# Altium schematic sheet Module - LCD.SchDoc
size A4; SheetNumber: 37; SheetTotal: 41
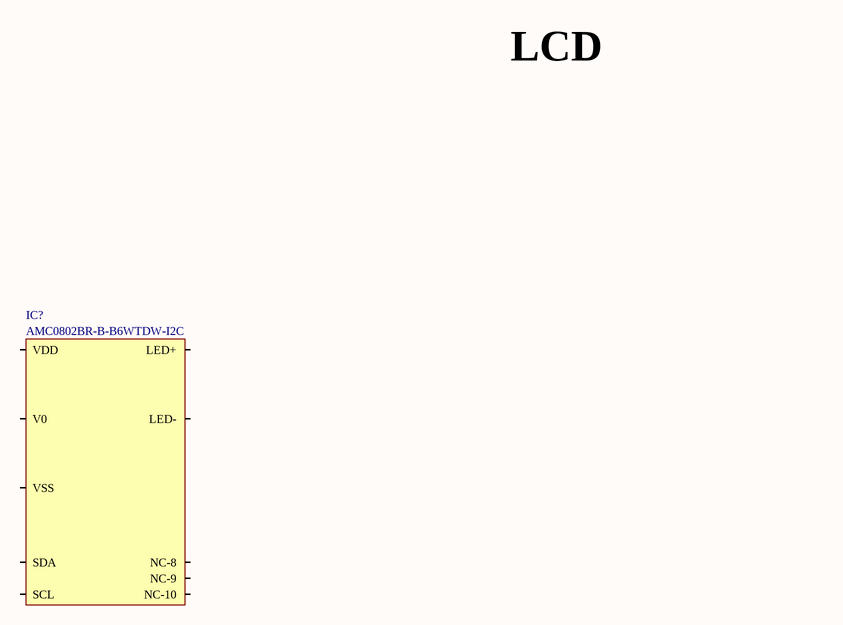
[diagram p0: Module - LCD.SchDoc]

## Parts
IC?  Manufacturer Part Number: AMC0802BR-B-B6WTDW-I2C  [Orient, AMC0802BR-B-B6WTDW-I2C]  (hidden comment: Orient, AMC0802BR-B-B6WTDW-I2C)

## Nets

Not connected (* = marked no-connect by the designer): IC? LED+ LED- NC-8 NC-9 NC-10 SCL SDA V0 VDD VSS

## Notes on the sheet
- LCD

## Library data of the parts
IC? = Orient, AMC0802BR-B-B6WTDW-I2C: Module, Display, Lcd, 2 Lines, I2C; Manufacturer: Orient Display; ComponentLink1Description: Datasheet; ComponentLink1URL: E:\Altium\Datasheets\Module - LCD\Orient, AMC0802BR-B-B6WTDW-I2C.pdf; ComponentLink2Description: Supplier Link; ComponentLink2URL: https://www.digikey.com/en/products/detail/orient-display/AMC0802BR-B-B6WTDW-I2C/12089222; Supplier: Digikey; Supplier Part Number: 3444-AMC0802BR-B-B6WTDW-I2C-ND; Operating Temperature, Min: -20℃; Operating Temperature, Max: +70℃; Quantity, Min: 1; Quantity, Max: 2000; Price, Min: 8.69; Supplier Currency: $; Price, Max: 4.21208; Supplier Link: https://www.digikey.com/en/products/detail/orient-display/AMC0802BR-B-B6WTDW-I2C/12089222; Component Type: LCD; Component Category: Module; Package: Custom